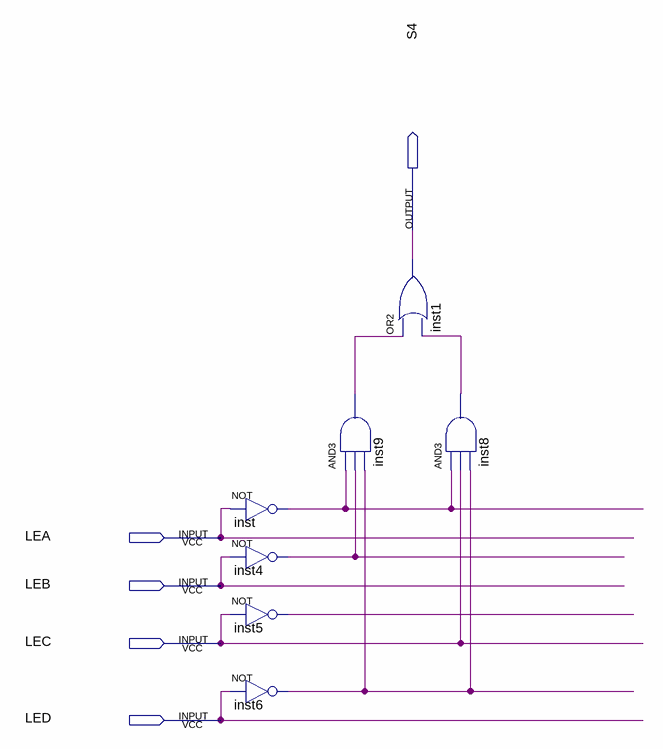
[diagram p0: schematic sheet]
// Quartus schematic Linha4.bdf as structural Verilog: 7 symbols, 5 pins
module Linha4 (
  input  LEA,
  input  LEB,
  input  LEC,
  input  LED,
  output S4
);

  wire inst4_out, inst5_out, inst6_out, inst8_out, inst9_out, inst_out;

  not inst (inst_out, LEA);
  not inst4 (inst4_out, LEB);
  not inst5 (inst5_out, LEC);
  not inst6 (inst6_out, LED);
  or inst1 (S4, inst9_out, inst8_out);
  and inst9 (inst9_out, inst_out, inst4_out, inst6_out);
  and inst8 (inst8_out, inst_out, LEC, inst6_out);
endmodule
